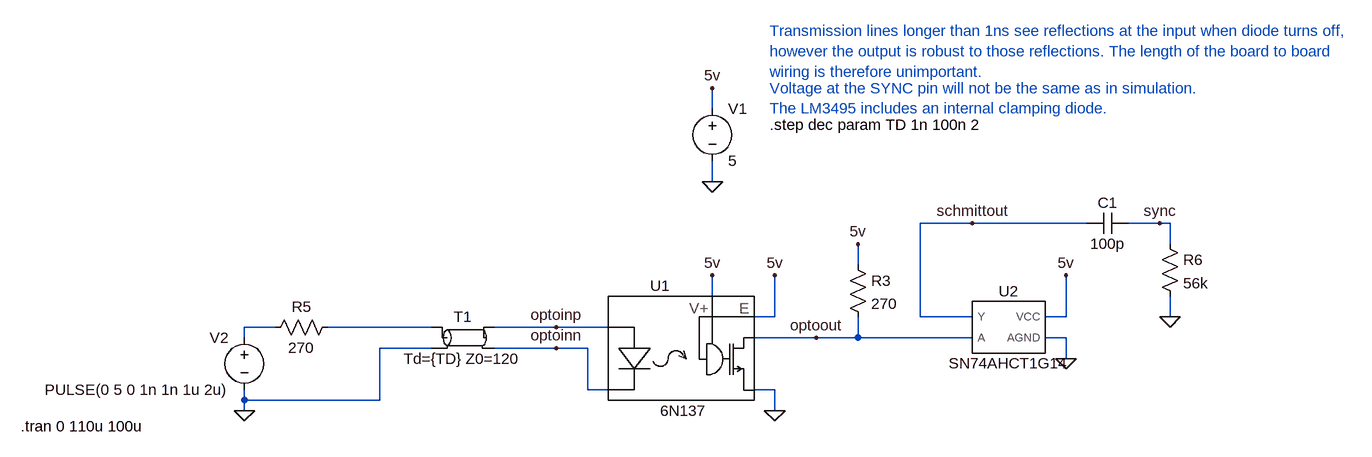
[diagram p0: schematic clock_isolator.asc]
clock_isolator.asc, the LTspice schematic file:
Version 4
SHEET 1 1468 680
WIRE 240 -192 240 -224
WIRE 240 -80 240 -112
WIRE 640 -16 560 -16
WIRE 816 -16 640 -16
WIRE 928 -16 880 -16
WIRE 944 -16 928 -16
WIRE 944 16 944 -16
WIRE 464 48 464 16
WIRE 240 96 240 64
WIRE 336 128 336 64
WIRE 336 128 304 128
WIRE 560 128 560 -16
WIRE 640 128 560 128
WIRE 784 128 784 64
WIRE 784 128 752 128
WIRE 944 128 944 96
WIRE -432 144 -480 144
WIRE -192 144 -352 144
WIRE 0 144 -96 144
WIRE 80 144 0 144
WIRE -480 160 -480 144
WIRE 400 160 304 160
WIRE 464 160 464 128
WIRE 464 160 400 160
WIRE 640 160 464 160
WIRE 784 160 752 160
WIRE -192 176 -272 176
WIRE 0 176 -96 176
WIRE 48 176 0 176
WIRE 784 192 784 160
WIRE 48 240 48 176
WIRE 80 240 48 240
WIRE 336 240 304 240
WIRE -480 256 -480 240
WIRE -272 256 -272 176
WIRE -272 256 -480 256
WIRE -480 272 -480 256
WIRE 336 272 336 240
FLAG 240 -80 0
FLAG 240 -224 5v
FLAG 240 64 5v
FLAG 336 272 0
FLAG -480 272 0
FLAG 944 128 0
FLAG 336 64 5v
FLAG 464 16 5v
FLAG 0 144 optoinp
FLAG 0 176 optoinn
FLAG 400 160 optoout
FLAG 784 64 5v
FLAG 784 192 0
FLAG 640 -16 schmittout
FLAG 928 -16 sync
SYMBOL 6N137 176 192 R0
SYMATTR InstName U1
SYMBOL voltage 240 -208 R0
SYMATTR InstName V1
SYMATTR Value 5
SYMBOL res 448 32 R0
SYMATTR InstName R3
SYMATTR Value 270
SYMBOL voltage -480 144 M0
WINDOW 123 0 0 Left 0
WINDOW 39 0 0 Left 0
SYMATTR InstName V2
SYMATTR Value PULSE(0 5 0 1n 1n 1u 2u)
SYMBOL res -336 128 R90
WINDOW 0 0 56 VBottom 2
WINDOW 3 32 56 VTop 2
SYMATTR InstName R5
SYMATTR Value 270
SYMBOL cap 880 -32 R90
WINDOW 0 0 32 VBottom 2
WINDOW 3 32 32 VTop 2
SYMATTR InstName C1
SYMATTR Value 100p
SYMBOL res 928 0 R0
SYMATTR InstName R6
SYMATTR Value 56k
SYMBOL tline -144 160 R0
SYMATTR InstName T1
SYMATTR Value Td={TD} Z0=120
SYMBOL SN74AHCT1G14 688 144 R0
SYMATTR InstName U2
TEXT -824 296 Left 2 !.tran 0 110u 100u
TEXT 328 -168 Left 2 !.step dec param TD 1n 100n 2
TEXT 328 -312 Left 2 ;Transmission lines longer than 1ns see reflections at the input when diode turns off,\nhowever the output is robust to those reflections. The length of the board to board\nwiring is therefore unimportant.
TEXT 328 -224 Left 2 ;Voltage at the SYNC pin will not be the same as in simulation.\nThe LM3495 includes an internal clamping diode.

The netlist it stands for:
* clock_isolator.asc
XU1 optoinp optoinn 0 optoout 5v 5v 6N137  ; pins A K S C V E
V1 5v 0 5
R3 5v optoout 270
V2 N001 0 PULSE(0 5 0 1n 1n 1u 2u)
R5 N002 N001 270
C1 sync schmittout 100p
R6 sync 0 56k
T1 N002 0 optoinp optoinn Td={TD} Z0=120
XU2 schmittout optoout 5v 0 SN74AHCT1G14  ; pins Y A VCC AGND
.tran 0 110u 100u
.step dec param TD 1n 100n 2
* Transmission lines longer than 1ns see reflections at the input when diode turns off,
* however the output is robust to those reflections. The length of the board to board
* wiring is therefore unimportant.
* Voltage at the SYNC pin will not be the same as in simulation.
* The LM3495 includes an internal clamping diode.
.lib 6N137.SUB
.lib C:\Users\osbor\Desktop\buck-converter-stability\ltspice\clock_isolator\SN74AHCT1G14.SUB
.backanno
.end